# EAGLE schematic schemat (EAGLE 8.4.1)
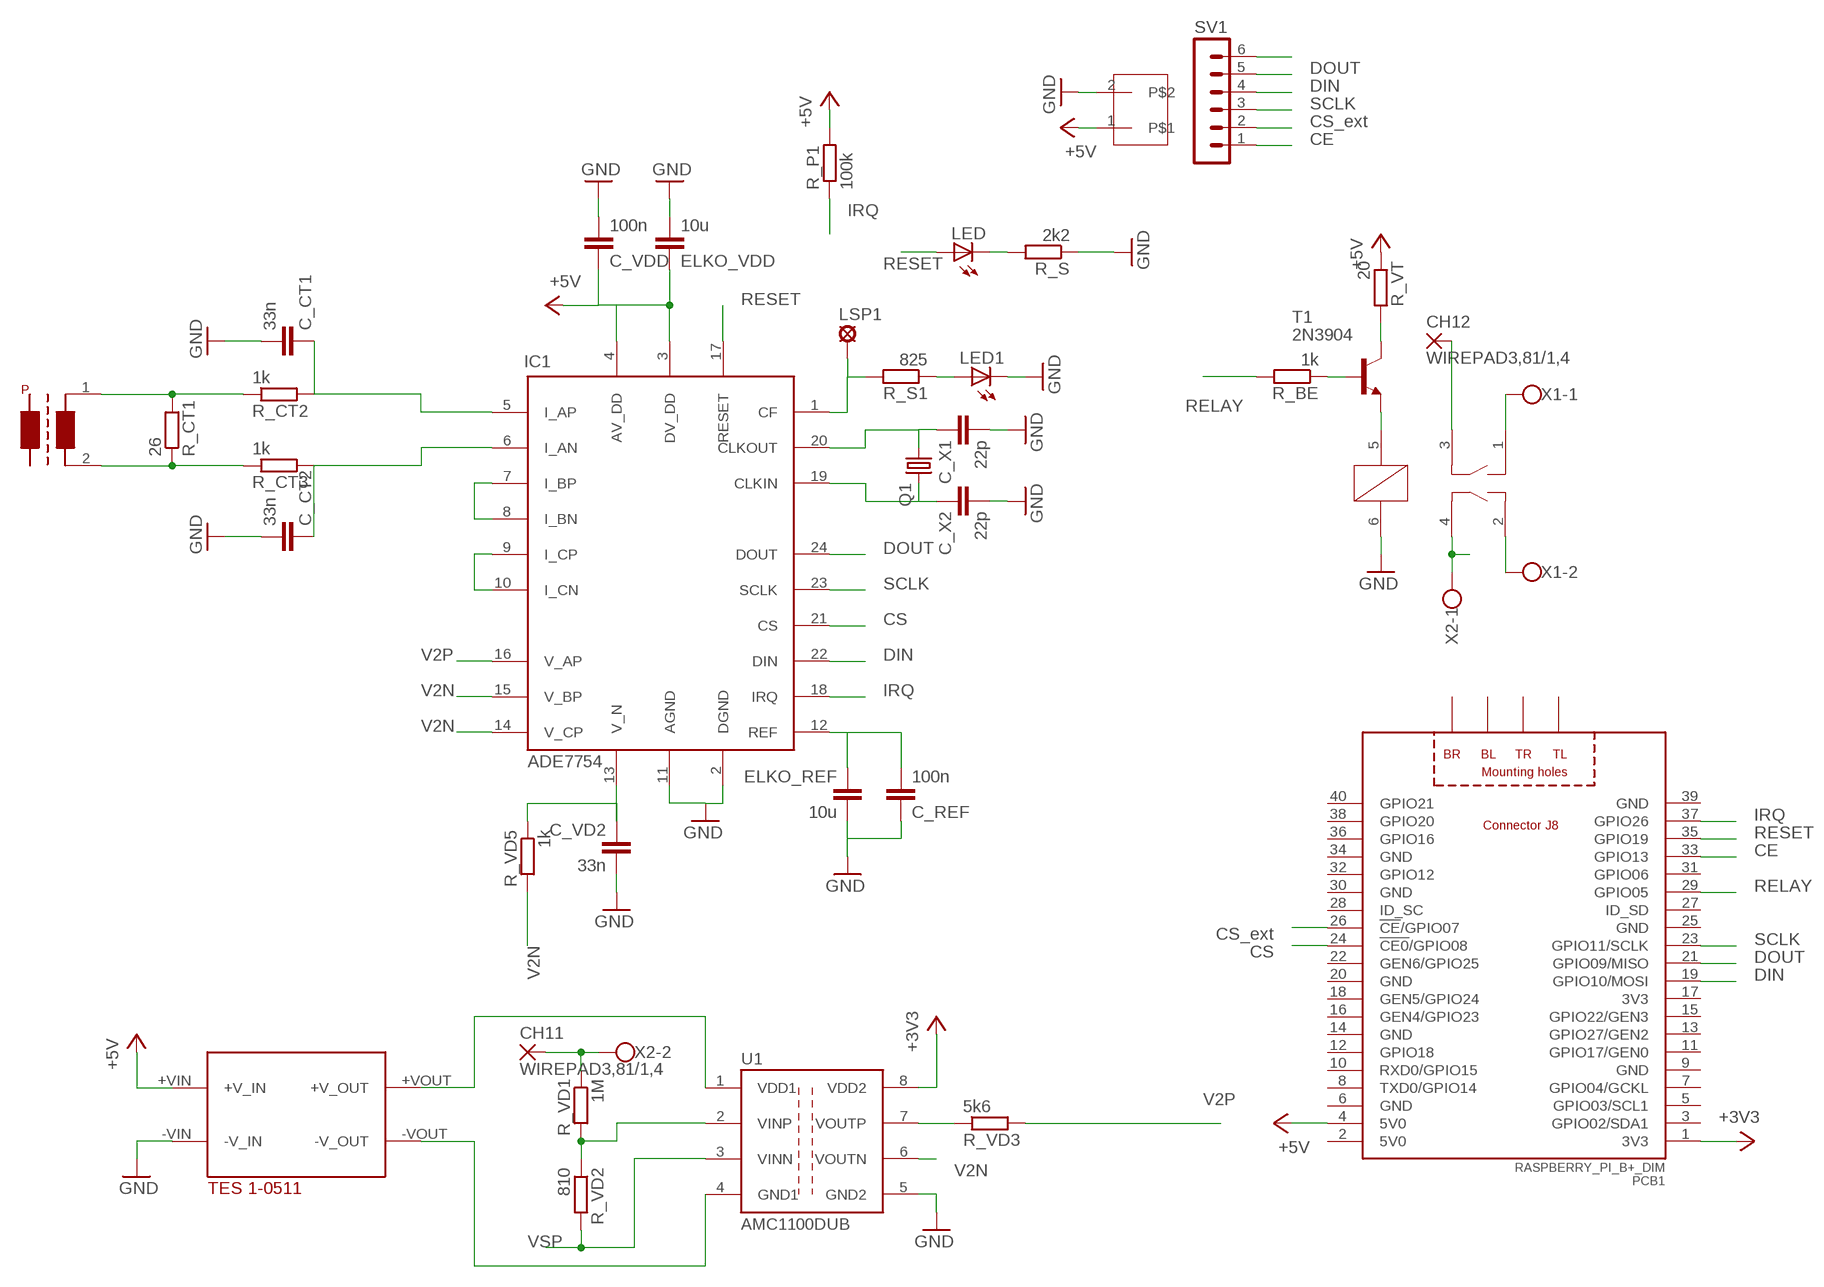
[diagram p0: schematic, sheet 1]

## Parts
C_CT1  33n  C-EUC1206K  [C1206K]
C_CT2  33n  C-EUC1206K  [C1206K]
C_REF  100n  C-EUC1206K  [C1206K]
C_VD2  33n  C-EUC1206K  [C1206K]
C_VDD  100n  C-EUC1206K  [C1206K]
C_X1  22p  C-EUC1206K  [C1206K]
C_X2  22p  C-EUC1206K  [C1206K]
CH11  WIREPAD3,81/1,4  [3,81/1,4]
CH12  WIREPAD3,81/1,4  [3,81/1,4]
ELKO_REF  10u  C7.5/3  [C7.5B3]
ELKO_VDD  10u  C7.5/3  [C7.5B3]
IC1  ADE7754  [SO24L]
LED  LED3MM  [LED3MM]
LED1  LED3MM  [LED3MM]
LSP1  LSP10  [LSP10]
PCB1  RASPBERRY_PI_B+_DIM  [RASPBERRY_PI_BPLUS_DIM]
Q1  CRYSTALHC18U-V  [HC18U-V]
R_BE  1k  R-EU_R2010  [R2010]
R_CT1  26  R-EU_R2512  [R2512]
R_CT2  1k  R-EU_R2010  [R2010]
R_CT3  1k  R-EU_R2010  [R2010]
R_P1  100k  R-EU_R2010  [R2010]
R_S  2k2  R-EU_R2512  [R2512]
R_S1  825  R-EU_R2512  [R2512]
R_VD1  1M  R-EU_R2512  [R2512]
R_VD2  810  R-EU_R2512  [R2512]
R_VD3  5k6  R-EU_R2512  [R2512]
R_VD5  1k  R-EU_R2010  [R2010]
R_VT  20  R-EU_R2512  [R2512]
SV1  MA06-1  [MA06-1]
T1  2N3904  [TO92]
U1  AMC1100DUB  [DIP8-GULLWING]
U$1  2-PINHEAD  [2-PINHEAD]
U$2  CST-1020  [CST1020]
U$3  TES1-0511  [0511]
U$4  G4W-2212P-US-TV5  [G4W-2212P-US-TV5]
X1  W237-102  [W237-102]
X2  W237-102  [W237-102]

## Nets
+3V3: PCB1.1(3V3) U1.8(VDD2)
+5V: C_VDD.1 ELKO_VDD.1 IC1.3(DV_DD) IC1.4(AV_DD) PCB1.4(5V0) R_P1.2 R_VT.1 U$1.1 U$3.+VIN(+V_IN)
CE: PCB1.33(GPIO13) SV1.1
CS: IC1.21(CS) PCB1.24(!CE0!/GPIO08)
CSE: PCB1.26(!CE!/GPIO07) SV1.2
DIN: IC1.22(DIN) PCB1.19(GPIO10/MOSI) SV1.4
DOUT: IC1.24(DOUT) PCB1.21(GPIO09/MISO) SV1.5
GND: C_CT1.2 C_CT2.2 C_REF.1 C_VD2.2 C_VDD.2 C_X1.2 C_X2.2 ELKO_REF.2 ELKO_VDD.2 IC1.2(DGND) IC1.11(AGND) LED1.K(C) R_S.1 U1.5(GND2) U$1.2 U$3.-VIN(-V_IN) U$4.6
IRQ: IC1.18(IRQ) PCB1.37(GPIO26) R_P1.1
N$1: C_REF.2 ELKO_REF.1 IC1.12(REF)
N$2: U$4.1 X1.1
N$3: C_VD2.1 IC1.13(V_N) R_VD5.1
N$4: R_BE.1 T1.2(B)
N$5: U$4.2 X1.2
N$6: CH12.1(P) U$4.3
N$7: IC1.1(CF) LSP1.MP R_S1.2
N$8: CH11.1(P) R_VD1.1 X2.2
N$9: R_VT.2 T1.1(C)
N$10: LED1.A R_S1.1
N$11: T1.3(E) U$4.5
N$12: R_VD1.2 R_VD2.1 U1.2(VINP)
N$13: IC1.7(I_BP) IC1.8(I_BN)
N$14: IC1.9(I_CP) IC1.10(I_CN)
N$17: R_CT1.2 R_CT2.1 U$2.1
N$18: SV1.6
N$26: R_VD3.1 U1.7(VOUTP)
N$28: LED.K(C) R_S.2
N$39: U1.1(VDD1) U$3.+VOUT(+V_OUT)
N$40: U1.4(GND1) U$3.-VOUT(-V_OUT)
N$80: R_CT1.1 R_CT3.1 U$2.2
N$97: C_CT2.1 IC1.6(I_AN) R_CT3.2
N$98: C_CT1.1 IC1.5(I_AP) R_CT2.2
N$102: C_X1.1 IC1.20(CLKOUT) Q1.1
N$103: C_X2.1 IC1.19(CLKIN) Q1.2
RELAY: PCB1.29(GPIO05) R_BE.2
RESET: IC1.17(RESET) LED.A PCB1.35(GPIO19)
SCLK: IC1.23(SCLK) PCB1.23(GPIO11/SCLK) SV1.3
V2N: IC1.14(V_CP) IC1.15(V_BP) R_VD5.2 U1.6(VOUTN)
V2P: IC1.16(V_AP) R_VD3.2
VSP: R_VD2.2 U1.3(VINN) U$4.4 X2.1
Unconnected: PCB1.3(GPIO02/SDA1) PCB1.5(GPIO03/SCL1) PCB1.7(GPIO04/GCKL) PCB1.8(TXD0/GPIO14) PCB1.10(RXD0/GPIO15) PCB1.11(GPIO17/GEN0) PCB1.12(GPIO18) PCB1.13(GPIO27/GEN2) PCB1.15(GPIO22/GEN3) PCB1.16(GEN4/GPIO23) PCB1.18(GEN5/GPIO24) PCB1.22(GEN6/GPIO25) PCB1.27(ID_SD) PCB1.28(ID_SC) PCB1.31(GPIO06) PCB1.32(GPIO12) PCB1.36(GPIO16) PCB1.38(GPIO20) PCB1.40(GPIO21) PCB1.PE_BL(BL) PCB1.PE_BR(BR) PCB1.PE_TL(TL) PCB1.PE_TR(TR)

## Notes on the sheet
- DOUT
- DIN
- SCLK
- CS_ext
- CE
- IRQ
- RESET
- RESET
- DOUT
- SCLK
- CS
- V2P | DIN
- IRQ
- IRQ
- RESET
- CE
- RELAY
- CS_ext
- CS | SCLK
- DOUT
- DIN

## Power pins joined to a net without a drawn wire
3V3: PCB1.17(3V3)
5V0: PCB1.2(5V0)
GND: PCB1.6(GND) PCB1.9(GND) PCB1.14(GND) PCB1.20(GND) PCB1.25(GND) PCB1.30(GND) PCB1.34(GND) PCB1.39(GND)

## Library data of the parts
C_CT1 C_CT2 C_REF C_VD2 C_VDD C_X1 C_X2 = resistor:C-EU: CAPACITOR, European symbol
CH11 CH12 = wirepad:WIREPAD: Wire PAD connect wire on PCB
ELKO_REF ELKO_VDD = capacitor-wima:C: CAPACITOR naming: grid - package width
IC1 = ADE7754:ADE7754
LED LED1 = led:LED: LED OSRAM: - CHIPLED LG R971, LG N971, LY N971, LG Q971, LY Q971, LO R971, LY R971 LH N974, LH R974 LS Q976, LO Q976, LY Q976 LO Q996 - Hyper CHIPLED LW Q18S LB Q993, LB Q99A, LB R99A - SideLED LS A670, LO A670, LY A670, LG A670, LP A670 LB A673, LV A673, LT A673, LW A673 LH A674 LY A675 LS A676, LA A676, LO A676, LY A676, LW A676 LS A679, LY A679, LG A679 - Hyper Micro SIDELED® LS Y876, LA Y876, LO Y876, LY Y876 LT Y87S - SmartLED LW L88C, LW L88S LB L89C, LB L89S, LG L890 LS L89K, LO L89K, LY L89K LS L896, LA L896, LO L896, LY L896 - TOPLED LS T670, LO T670, LY T670, LG T670, LP T670 LSG T670, LSP T670, LSY T670, LOP T670, LYG T670 LG T671, LOG T671, LSG T671 LB T673, LV T673, LT T673, LW T673 LH T674 LS T676, LA T676, LO T676, LY T676, LB T676, LH T676, LSB T676, LW T676 LB T67C, LV T67C, LT T67C, LS T67K, LO T67K, LY T67K, LW E67C LS E67B, LA E67B, LO E67B, LY E67B, LB E67C, LV E67C, LT E67C LW T67C LS T679, LY T679, LG T679 LS T770, LO T770, LY T770, LG T770, LP T770 LB T773, LV T773, LT T773, LW T773 LH T774 LS E675, LA E675, LY E675, LS T675 LS T776, LA T776, LO T776, LY T776, LB T776 LHGB T686 LT T68C, LB T68C - Hyper Mini TOPLED® LB M676 - Mini TOPLED Santana® LG M470 LS M47K, LO M47K, LY M47K Source: http://www.osram.convergy.de LUXEON: - LUMILED® LXK2-PW12-R00, LXK2-PW12-S00, LXK2-PW14-U00, LXK2-PW14-V00 LXK2-PM12-R00, LXK2-PM12-S00, LXK2-PM14-U00 LXK2-PE12-Q00, LXK2-PE12-R00, LXK2-PE12-S00, LXK2-PE14-T00, LXK2-PE14-U00 LXK2-PB12-K00, LXK2-PB12-L00, LXK2-PB12-M00, LXK2-PB14-N00, LXK2-PB14-P00, LXK2-PB14-Q00 LXK2-PR12-L00, LXK2-PR12-M00, LXK2-PR14-Q00, LXK2-PR14-R00 LXK2-PD12-Q00, LXK2-PD12-R00, LXK2-PD12-S00 LXK2-PH12-R00, LXK2-PH12-S00 LXK2-PL12-P00, LXK2-PL12-Q00, LXK2-PL12-R00 Source: www.luxeon.com KINGBRIGHT: KA-3528ASYC Source: www.kingbright.com
LSP1 = solpad:LSP10: SOLDER PAD drill 1.0 mm, distributor Buerklin, 12H555
PCB1 = RASPBERRY_PI_Bplus-eagle5:RASPBERRY_PI_B+: Raspberry Pi B+ Basedon issue: Thursday, July 10, 2014 - Rev 1.2 LBR by Tim Rettmann 07-2014
Q1 = crystal:CRYSTAL: CRYSTAL; OC_FARNELL: unknown; OC_NEWARK: unknown
R_BE R_CT1-R_CT3 R_P1 R_S R_S1 R_VD1-R_VD3 R_VD5 R_VT = resistor:R-EU_: RESISTOR, European symbol
SV1 = con-lstb:MA06-1: PIN HEADER; OC_FARNELL: unknown; OC_NEWARK: unknown
T1 = transistor:2N3904: NPN TRANSISTOR
U1 = _hhn_AMC1100_ISO7240_ADS130:AMC1100*: AMC1100 Texas Instruments Fully-Differential Isolation Amplifier for Energy Metering Package: DIP-08 Gullwing (TI-postfix "DUB") Author: Dipl.-Ing. FH Rainer Bayer Hochschule Heilbronn: http://www.hochschule-heilbronn.de/rainer.bayer <http://www.hs-heilbronn.de/rainer.bayer> – rainer.bayer@hs-heilbronn.de Ingenieurbüro ing-rb: http://www.ing-rb.de/ – eagle@ing-rb.de Dozent dozent-rb: http://www.dozent-rb.de/ – eagle@dozent-rb.de
U$1 = 2-PINHEAD:2-PINHEAD
U$2 = cst:CST-1020
U$3 = TES1-0511:TES1-0511
U$4 = power_relay:G4W-2212P-US-TV5
X1 X2 = con-wago-500:W237-102: WAGO SCREW CLAMP; MPN: 237-102; OC_FARNELL: unknown; OC_NEWARK: 70K9898